# EAGLE design Harvester70 (EAGLE 9.4.0)
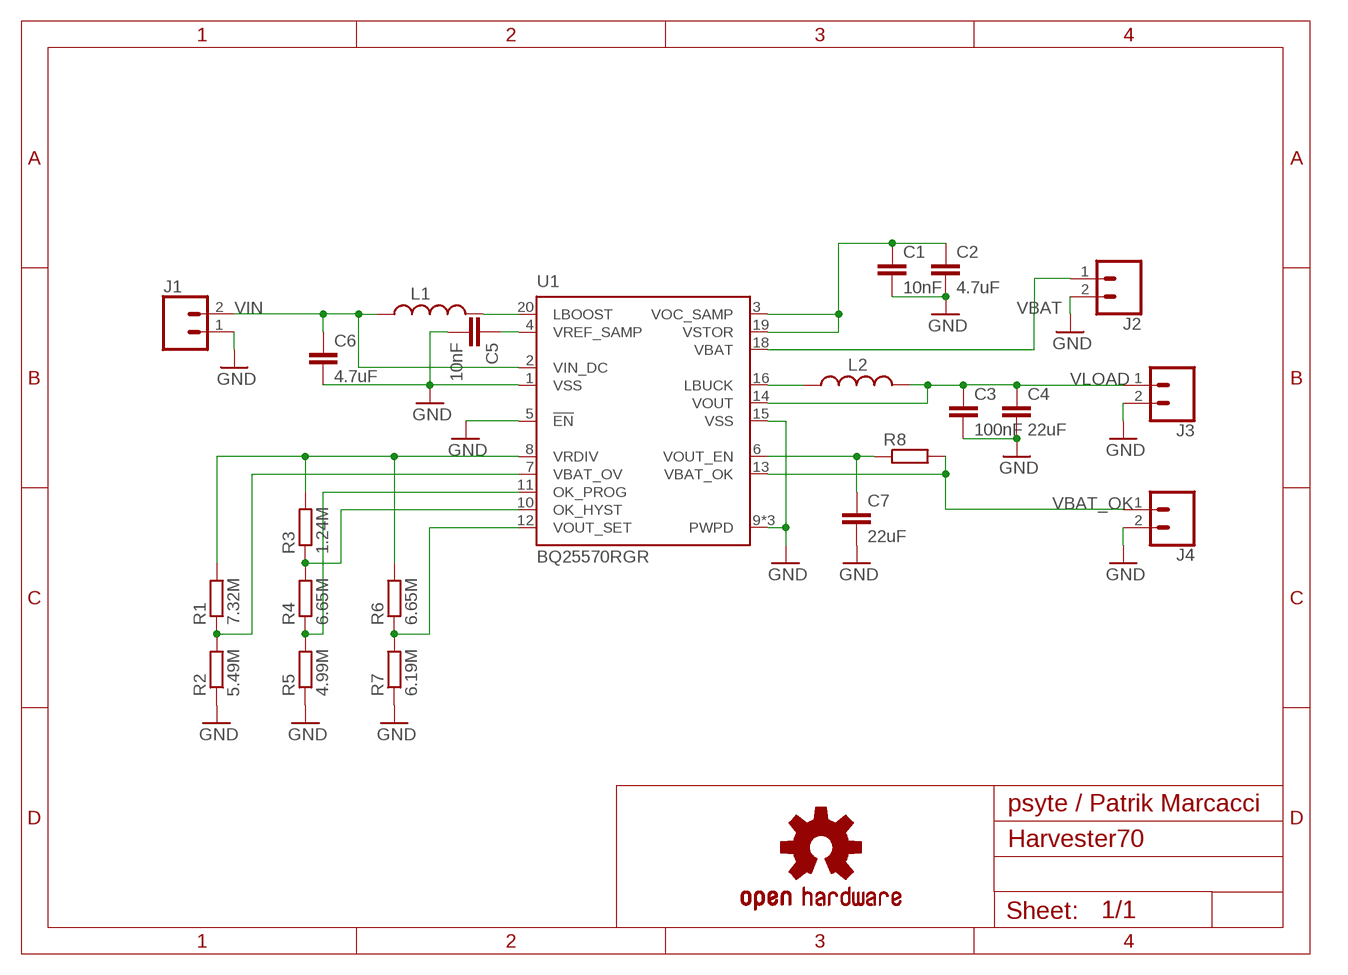
[diagram p0: schematic, sheet 1]

## Parts
C1  10nF  C-EUC0603K  [C0603K]
C2  4.7uF  C-EUC0603K  [C0603K]
C3  100nF  C-EUC0603K  [C0603K]
C4  22uF  C-EUC0603K  [C0603K]
C5  10nF  C-EUC0603K  [C0603K]
C6  4.7uF  C-EUC0603K  [C0603K]
C7  22uF  C-EUC0603K  [C0603K]
J1  CONN_02  [1X02]
J2  CONN_02  [1X02]
J3  CONN_02  [1X02]
J4  CONN_02  [1X02]
L1  LPS4018-223M  COILCRAFT-LPS4018  [LPS4018]
L2  LPS4018-103M  COILCRAFT-LPS4018  [LPS4018]
LOGO2  OSHW-LOGOS  [OSHW-LOGO-S]
R1  7.32M  R-EU_R0603  [R0603]
R2  5.49M  R-EU_R0603  [R0603]
R3  1.24M  R-EU_R0603  [R0603]
R4  6.65M  R-EU_R0603  [R0603]
R5  4.99M  R-EU_R0603  [R0603]
R6  6.65M  R-EU_R0603  [R0603]
R7  6.19M  R-EU_R0603  [R0603]
R8  R-EU_R0603  [R0603]
U1  BQ25570RGR  [RGR_S-PVQFN-N20]

## Nets
GND: C1.2 C2.2 C3.2 C4.2 C5.2 C6.2 C7.2 J1.1 J2.2 J3.2 J4.2 R2.1 R5.1 R7.1 U1.1(VSS) U1.5(!EN) U1.9(PWPD) U1.15(VSS) U1.17(PWPD) U1.EXP(PWPD)
N$1: R1.1 R2.2 U1.7(VBAT_OV)
N$2: R4.1 R5.2 U1.11(OK_PROG)
N$3: R3.1 R4.2 U1.10(OK_HYST)
N$4: R6.1 R7.2 U1.12(VOUT_SET)
N$5: C1.1 C2.1 U1.3(VOC_SAMP) U1.19(VSTOR)
N$6: C7.1 R8.1 U1.6(VOUT_EN)
N$7: L2.1 U1.16(LBUCK)
N$9: L1.2 U1.20(LBOOST)
N$12: C5.1 U1.4(VREF_SAMP)
VBAT: J2.1 U1.18(VBAT)
VBAT_OK: J4.1 R8.2 U1.13(VBAT_OK)
VIN: C6.1 J1.2 L1.1 U1.2(VIN_DC)
VLOAD: C3.1 C4.1 J3.1 L2.2 U1.14(VOUT)
VRDIV: R1.2 R3.2 R6.2 U1.8(VRDIV)

## Notes on the sheet
- psyte / Patrik Marcacci

## Library data of the parts
C1-C7 = rcl:C-EU: CAPACITOR, European symbol; SPICEPREFIX: C
J1-J4 = SparkFun-Connectors:CONN_02: Multi connection point. Often used as Generic Header-pin footprint for 0.1 inch spaced/style header connections On any of the 0.1 inch spaced packages, you can populate with these: Break Away Headers - Straight <https://www.sparkfun.com/products/116> (PRT-00116) Break Away Male Headers - Right Angle <https://www.sparkfun.com/products/553> (PRT-00553) Female Headers <https://www.sparkfun.com/products/115> (PRT-00115) Break Away Headers - Machine Pin <https://www.sparkfun.com/products/117> (PRT-00117) Break Away Female Headers - Swiss Machine Pin <https://www.sparkfun.com/products/743> (PRT-00743) For SCREWTERMINALS and SPRING TERMINALS visit here: Screw Terimnals on SparkFun.com <https://www.sparkfun.com/search/results?term=Screw+Terminals> (5mm/3.5mm/2.54mm spacing) This device is also useful as a general connection point to wire up your design to another part of your project. Our various solder wires solder well into these plated through hole pads. Hook-Up Wire - Assortment (Stranded, 22 AWG) <https://www.sparkfun.com/products/11375> (PRT-11375) Hook-Up Wire - Assortment (Solid Core, 22 AWG) <https://www.sparkfun.com/products/11367> (PRT-11367) View the entire wire category on our website here <https://www.sparkfun.com/categories/141> Special notes: Molex polarized connector foot print use with: PRT-08233 with associated crimp pins and housings. 2.54_SCREWTERM for use with PRT-10571. 3.5mm Screw Terminal footprints for PRT-08084 5mm Screw Terminal footprints for use with PRT-08432
L1 L2 = passives:COILCRAFT-LPS4018: Coilcraft Shielded SMT Power Inductors – LPS4018 Series
LOGO2 = SparkFun-Aesthetics:OSHW-LOGO: Open-Source Hardware (OSHW) Logo This logo indicates the piece of hardware it is found on incorporates a OSHW license and/or adheres to the definition of open source hardware found here: http://freedomdefined.org/OSHW
R1-R8 = rcl:R-EU_: RESISTOR, European symbol; SPICEPREFIX: R
U1 = energy-harvesting-pmic:BQ25570: Ultra Low Power Harvester Power Management IC with Boost Charger, and Nanopower Buck Converter The bq25570 device is specifically designed to efficiently extract microwatts (µW) to milliwatts (mW) of power generated from a variety of high output impedance DC sources like photovoltaic (solar) or thermal electric generators (TEG) without collapsing those sources. The battery management features ensure that a rechargeable battery is not overcharged by this extracted power, with voltage boosted, or depleted beyond safe limits by a system load. In addition to the highly efficient boosting charger, the bq25570 integrates a highly efficient, nano- power buck converter for providing a second power rail to systems such as wireless sensor networks (WSN) which have stringent power and operational demands. All the capabilities of bq25570 are packed into a small foot-print 20-lead 3.5-mm × 3.5-mm QFN package (RGR). Source: http://www.ti.com/product/BQ25570

## Board
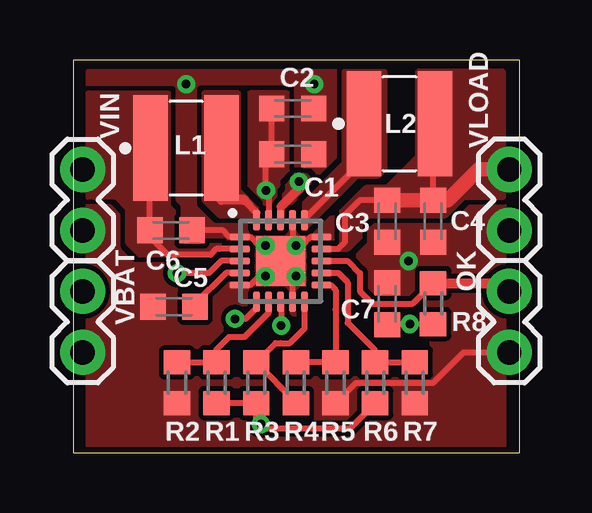
[diagram p1: board, top side]
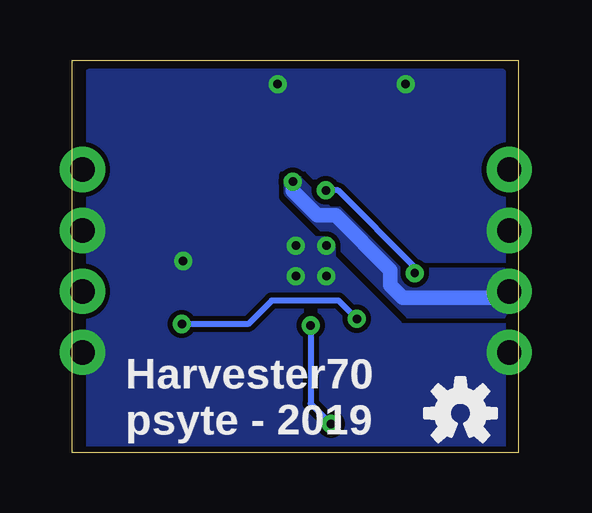
[diagram p2: board, bottom side, seen from below]

Size 18.59 x 16.37 mm. Coordinates in mm from the lower left corner, seen from the top.
Outline: 0,0 18.59,0 18.59,16.37 0,16.37 0,0
Copper layers (1*16): Top 0.035mm / dielectric 1.5mm / Bottom 0.035mm
Design rules "default *": minimum track width 8mil, minimum drill 0.35mm, track to track 8mil, track to pad 8mil, pad to pad 8mil, via to via 8mil, smd to smd 8mil, copper to edge 10mil, drill to drill 8mil, minimum pad ring 10mil, minimum via ring 8mil, stop-mask expansion 2mil, vias tented up to drill 14mil, thermal gap 10mil

### Footprints (pad centres in the part's own frame; a part is rotated, then mirrored left to right if it is on the bottom)
C0603K = smd 1.05 x 1.08: 1 -0.875,0; 2 0.875,0
1X02 = drill 1.016 pad 1.88: 1 0,0; 2 2.54,0
LPS4018 = smd 1.435 x 4.394: 1 -1.48,0; 2 1.48,0
R0603 = smd 1 x 1.1: 1 -0.85,0; 2 0.85,0
RGR_S-PVQFN-N20 = smd 0.85 x 0.3: 1 -1.7,1; 2 -1.7,0.5; 3 -1.7,0; 4 -1.7,-0.5; 5 -1.7,-1; 11 1.7,-1; 12 1.7,-0.5; 13 1.7,0; 14 1.7,0.5; 15 1.7,1 | smd 0.3 x 0.85: 6 -1,-1.7; 7 -0.5,-1.7; 8 0,-1.7; 9 0.5,-1.7; 10 1,-1.7; 16 1,1.7; 17 0.5,1.7; 18 0,1.7; 19 -0.5,1.7; 20 -1,1.7 | smd 2.05 x 2.05: EXP 0,0

### Placement (x,y rotation side)
C1  9.14,12.45 0 top
C2  9.14,14.35 0 top
C3  13.08,9.65 270 top
C4  14.99,9.65 270 top
C5  4.19,6.1 180 top
C6  4.06,9.27 0 top
C7  13.08,6.22 90 top
J1  0.38,9.27 90 top
J2  0.38,6.73 270 top
J3  18.16,11.81 270 top
J4  18.16,6.73 270 top
L1  4.7,12.7 0 top
L2  13.59,13.72 0 top
LOGO2  2.41,1.65 0 bottom
R1  5.97,2.92 270 top
R2  4.32,2.92 90 top
R3  7.62,2.92 270 top
R4  9.27,2.92 270 top
R5  10.92,2.92 90 top
R6  12.57,2.92 270 top
R7  14.22,2.92 90 top
R8  14.99,6.22 90 top
U1  8.64,8 0 top

### Tracks (layer width: path | path; a pad name or v marks a point on that pad's centre or on a via)
GND  (via drill 0.35)
  Top 0.254: U1.5 7.38,7 7.75,7.37 v8,7.37 | U1.17 9.14,8.77 v9.27,8.64 9.52,8.64 9.89,9 U1.15 | U1.9 9.14,7.23 v9.27,7.37 | v8,8.64 7.75,8.64 7.38,9 U1.1 6.92,9.02 6.48,9.02 6.22,9.27 C6.2 | R5.1 11.77,2.92 14.99,2.92 16.26,4.19 J4.2
  other vias: 4.7,15.37 10.03,15.37 13.97,8
  pour Top (rank 6, no thermals): 0.64,15.88 17.91,15.88 17.91,0 0.64,0
  pour Bottom (rank 6, no thermals): 0.64,15.88 17.91,15.88 17.91,0 0.64,0
N$1
  Top 0.254: R2.2 R1.1 5.97,4.32 6.48,4.83 7.11,4.83 8.14,5.85 U1.7
N$2
  Top 0.254: R4.1 R5.2 10.92,5.98 10.92,6.8 10.72,7 U1.11
N$3
  Top 0.254: U1.10 9.64,5.19 9.02,4.57 8.64,4.57 8.42,4.57 R3.1 9.27,2.12 R4.2
N$4
  Top 0.254: U1.12 11.04,7.5 11.43,7.11 11.43,5.42 12.57,4.28 R6.1 R7.2
N$5  (via drill 0.35)
  Top 0.254: C2.1 C1.1 8.02,12.2 v8.02,10.94 8.02,10.82 8.14,10.7 U1.19 | v4.32,7.49 5.65,7.49 6.16,8 U1.3
  Bottom 0.254: v8.02,10.94 7.51,10.94 4.32,7.75 v4.32,7.49
  pour Top (no thermals): 7.37,14.99 7.37,11.18 8,10.54 8,10.41 8.13,10.41 8.38,10.67 8.38,11.05 8.51,11.18 8.51,11.43 8.89,11.81 8.89,14.99
N$6  (via drill 0.35)
  Top 0.254: R8.1 v14.02,5.37 13.11,5.37 C7.1 | v6.73,5.59 7.18,5.59 7.64,6.05 U1.6
  Bottom 0.254: v6.73,5.59 7.49,6.35 10.29,6.35 11.26,5.37 v14.02,5.37
N$7
  Top 0.254: U1.16 9.64,9.76 12.11,12.24 L2.1
  pour Top (no thermals): 9.65,9.78 9.65,10.41 11.3,12.07 11.3,12.19 11.3,15.88 12.95,15.88 12.95,11.81 12.7,11.56 11.81,11.56 11.68,11.43 9.65,9.4 9.65,9.65 9.91,9.91
N$9
  Top 0.254: U1.20 7.64,10.02 | 6.18,10.54 L1.2
  Top 0.305: 7.64,10.02 7.11,10.54
  Top 0.406: 7.11,10.54 6.18,10.54
  pour Top (no thermals): 5.46,14.99 5.46,10.54 6.1,9.91 7.37,9.91 7.62,9.91 7.62,10.16 6.86,10.92 6.86,14.99
N$12
  Top 0.254: U1.4 6.36,7.5 5.07,6.21 C5.1
VBAT  (via drill 0.35)
  Top 0.305: U1.18 8.64,10.25
  Top 0.356: 8.64,10.25 9.4,11.02
  Top 0.406: 9.4,11.02 v9.4,11.3
  Bottom 0.61: J2.1 0.64,6.48 4.83,6.48 5.33,6.98 5.33,7.62 7.62,9.91 8.38,9.91 9.4,10.92 v9.4,11.3
  pour Top (rank 2, no thermals): 8.64,10.29 8.64,10.41 8.76,10.54 8.76,11.05 9.27,11.56 9.65,11.56 9.78,11.43 9.78,11.18 8.89,10.29
  pour Bottom (no thermals): 9.14,11.43 7.87,10.16 7.49,10.16 4.95,7.62 0.64,7.62 0.64,5.71 4.57,5.71 9.52,10.67 9.65,10.79 9.65,11.43
VBAT_OK
  Top 0.254: U1.13 11.43,8 11.94,7.49 11.94,6.73 12.45,6.22 14.14,6.22 R8.2
  Top 0.406: R8.2 17.82,7.07 J4.1
VIN
  Top 0.254: U1.2 6.1,8.5 5.96,8.5 5.71,8.26 3.94,8.26 3.19,9 C6.1 3.19,12.67 L1.1
  pour Top (no thermals): 0.64,14.99 3.94,14.99 3.94,10.29 5.59,8.64 6.1,8.64 5.71,8.26 2.79,8.26 2.29,8.76 2.29,10.16 1.78,10.67 0.64,10.67
VLOAD
  Top 0.254: U1.14 11.04,8.5 11.3,8.76 11.3,9.91 11.92,10.53 C3.1 | C4.1 14.99,13.63 L2.2
  Top 0.61: C3.1 C4.1 15.61,10.53 16.89,11.81 J3.1
  pour Top (no thermals): 14.35,15.88 14.35,12.32 13.08,11.05 12.19,11.05 11.18,10.03 11.18,8.76 11.18,8.51 11.43,8.51 11.81,8.89 11.94,9.02 11.94,9.53 12.32,9.91 15.49,9.91 16.26,10.67 17.91,10.67 17.91,15.88
VRDIV  (via drill 0.35)
  Top 0.254: R6.2 11.52,1.02 8,1.02 v7.81,1.21 7.62,1.4 R3.2 R1.2 | U1.8 8.66,6.28 v8.66,5.31
  Bottom 0.254: v8.66,5.31 8.66,2.05 v7.81,1.21

### Text on the board
tPlace: VIN | VLOAD | OK | VBAT
bPlace: Harvester70 / psyte - 2019
tNames: L2 | L1